# EasyEDA Pro project IPM_24V_12V分电板.eprj

# Schematic Schematic1

## Sheets
1 P1: Board Name: Board1; Create Date: 2025-09-07; Page Name: P1; Project Name: IPM_24V_12V分电板; Schematic Name: Schematic1; Update Date: 2025-10-30; Company: 嘉立创EDA; Page Size: A4; Version: V1.0
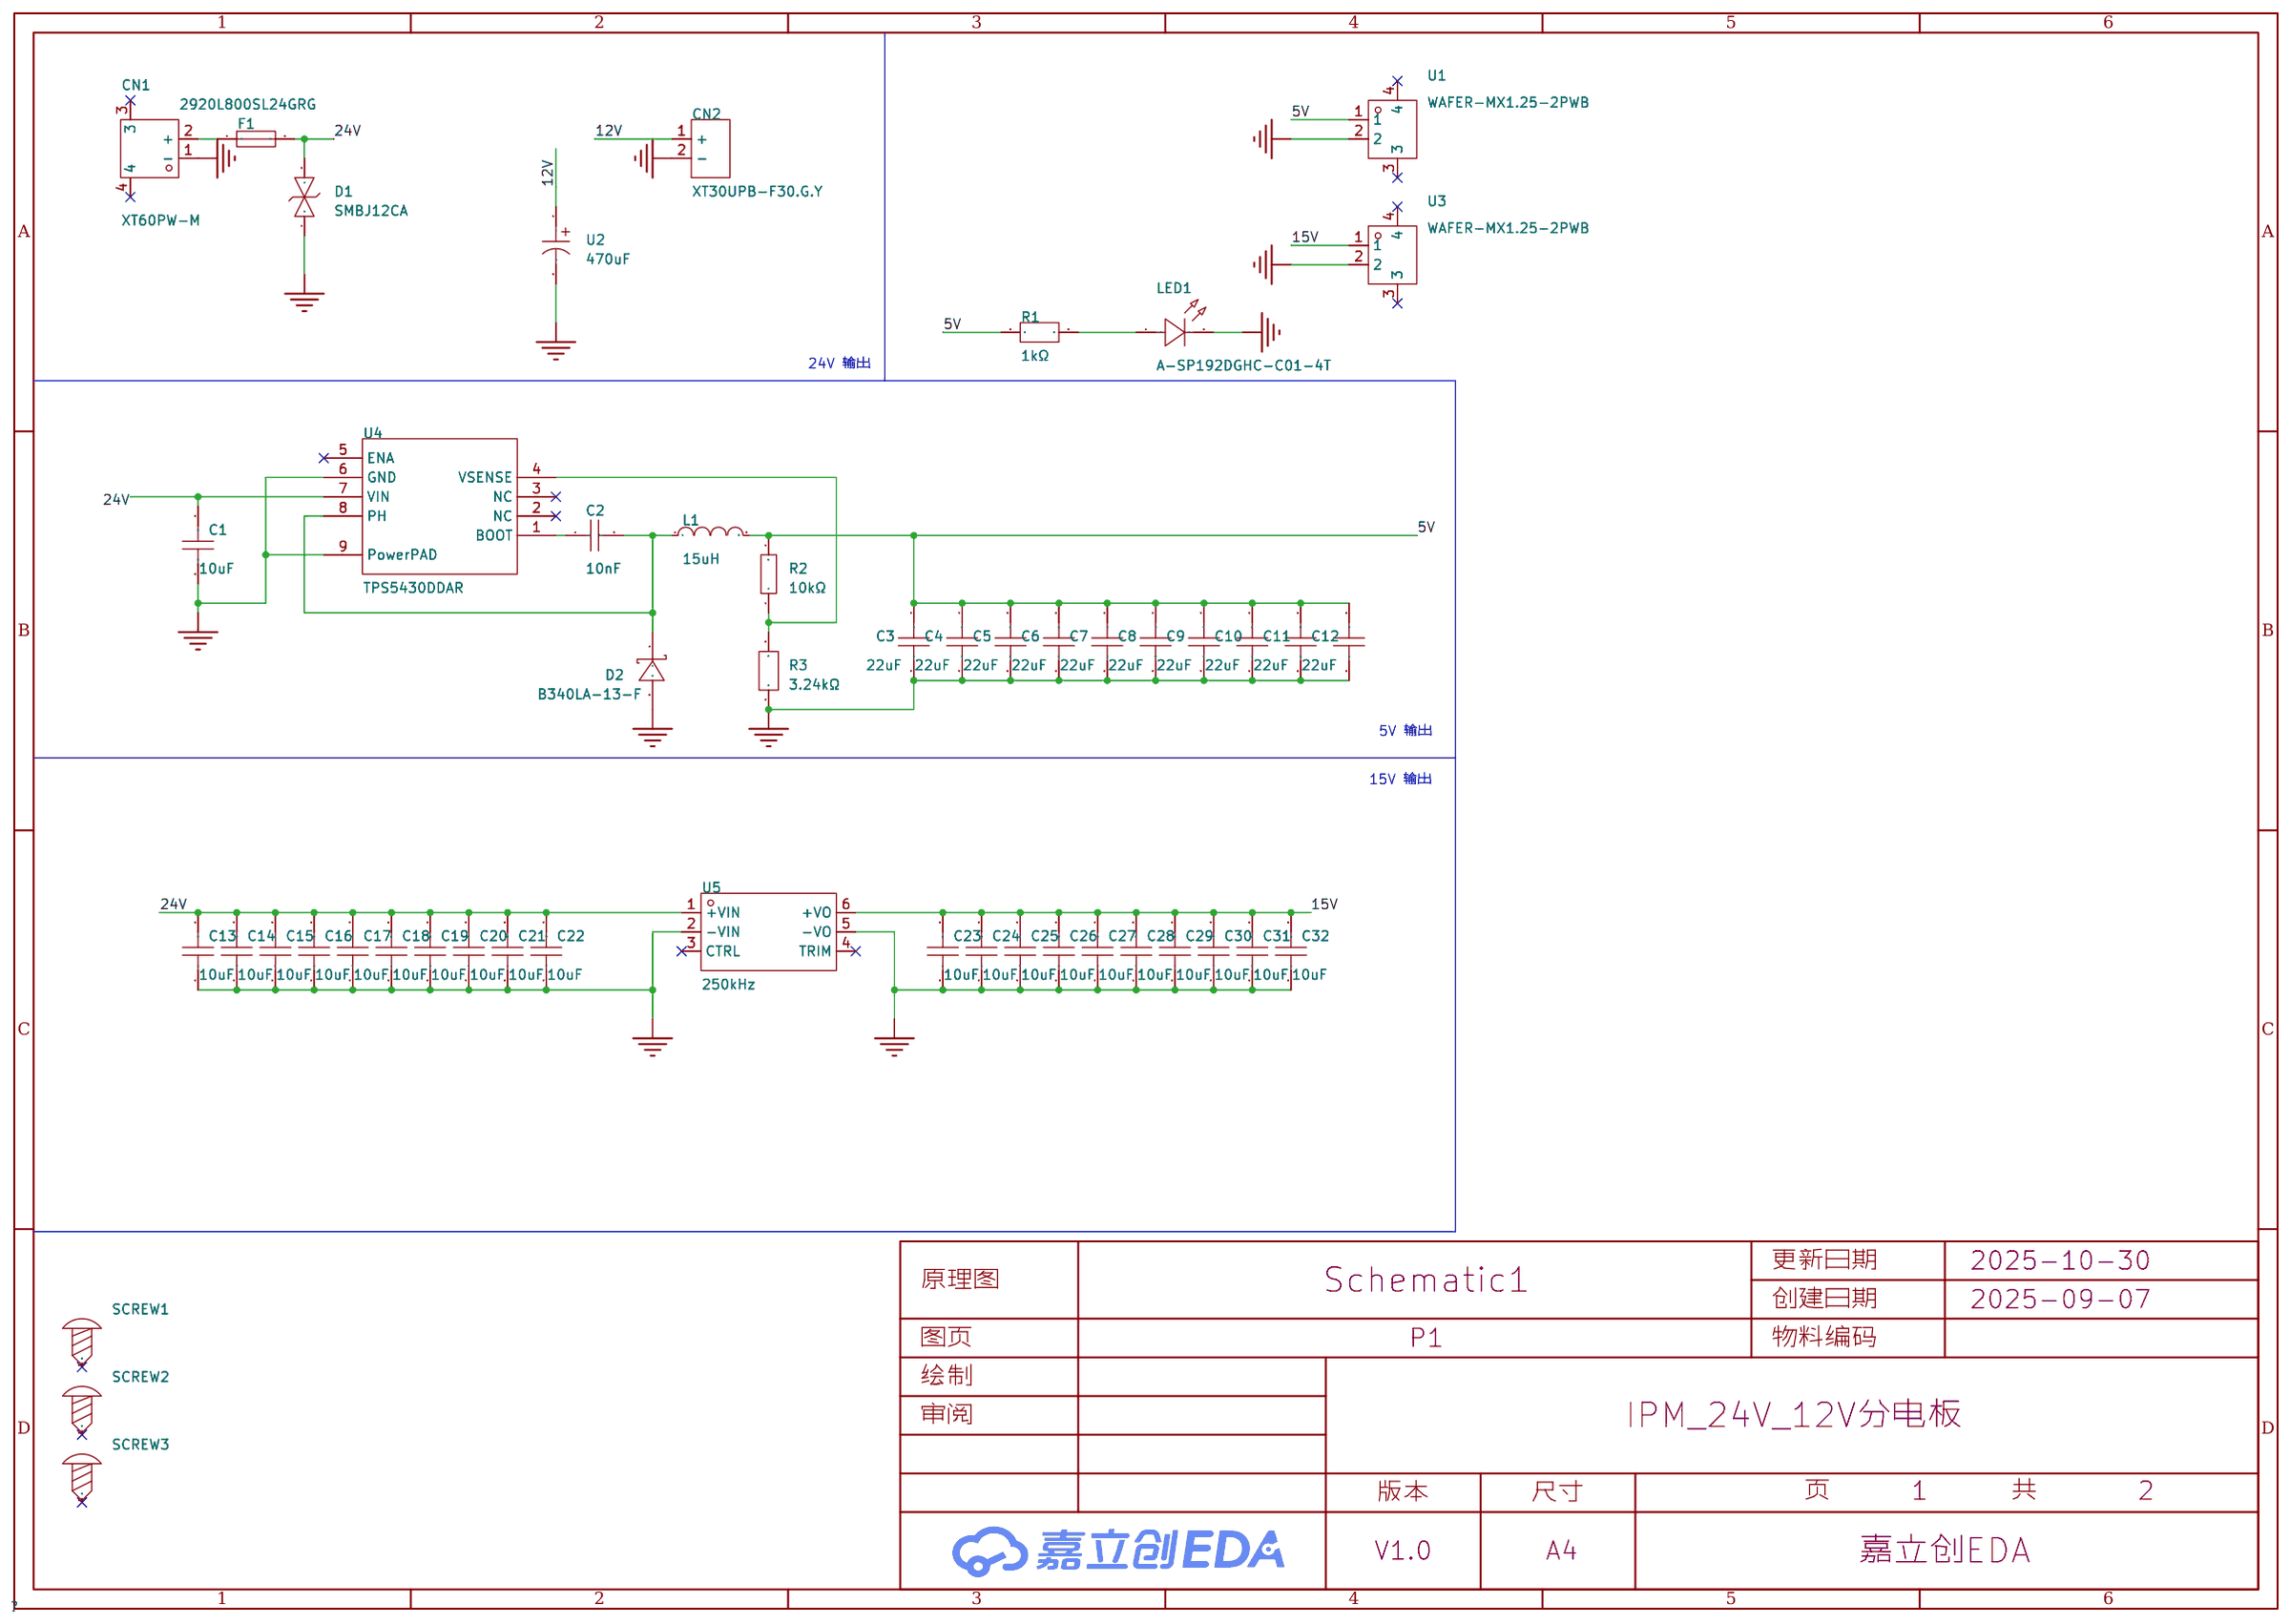
[diagram p0: P1]
2 P2: Create Date: 2025-10-30; Page Name: P2
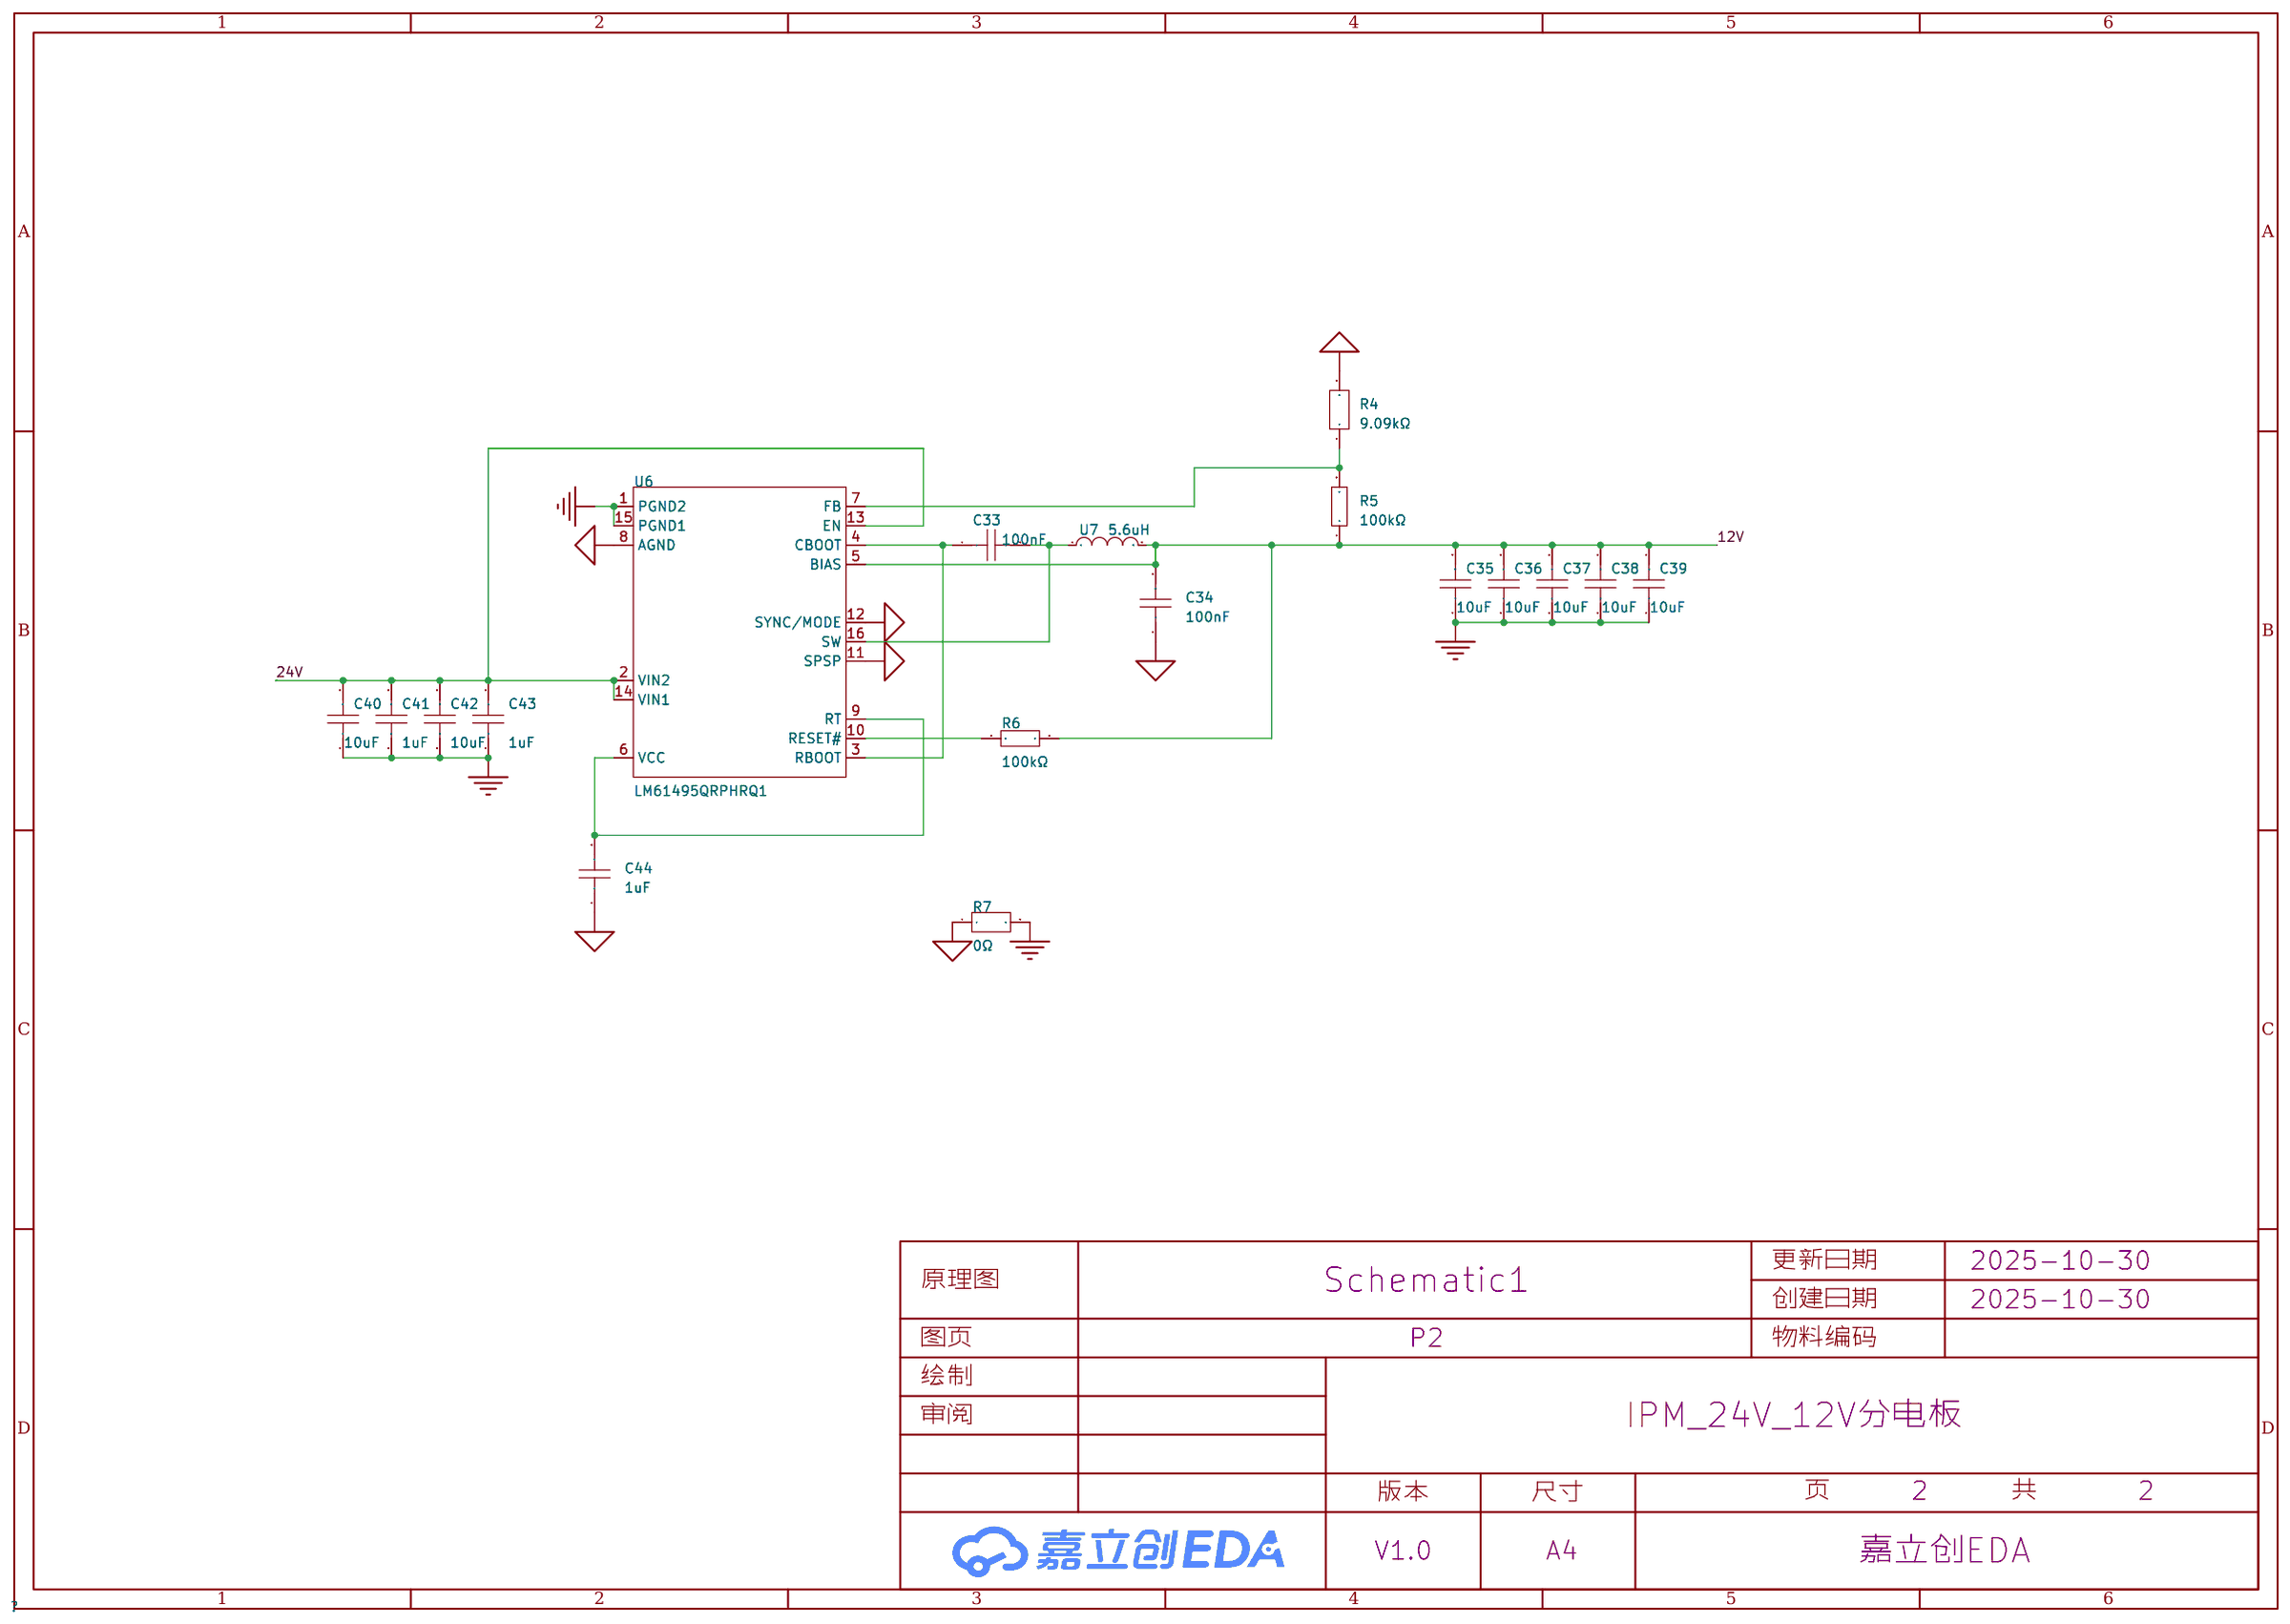
[diagram p1: P2]

## Parts
sheet P1
C1  10uF  [C1206]
C2  10nF  [C0603]
C3  22uF  [C0603]
C4  22uF  [C0603]
C5  22uF  [C0603]
C6  22uF  [C0603]
C7  22uF  [C0603]
C8  22uF  [C0603]
C9  22uF  [C0603]
C10  22uF  [C0603]
C11  22uF  [C0603]
C12  22uF  [C0603]
C13  10uF  [C1206]
C14  10uF  [C1206]
C15  10uF  [C1206]
C16  10uF  [C1206]
C17  10uF  [C1206]
C18  10uF  [C1206]
C19  10uF  [C1206]
C20  10uF  [C1206]
C21  10uF  [C1206]
C22  10uF  [C1206]
C23  10uF  [C1206]
C24  10uF  [C1206]
C25  10uF  [C1206]
C26  10uF  [C1206]
C27  10uF  [C1206]
C28  10uF  [C1206]
C29  10uF  [C1206]
C30  10uF  [C1206]
C31  10uF  [C1206]
C32  10uF  [C1206]
CN1  XT60PW-M  [CONN-TH_XT60PW-M]
CN2  XT30UPB-F30.G.Y  [CONN-TH_XT30UPB-F]
D1  SMBJ12CA  [SMB_L4.6-W3.6-LS5.4-BI]
D2  B340LA-13-F  [SMA_L4.3-W2.6-LS5.2-RD]
F1  2920L800SL24GRG  [F2920]
L1  15uH  [IND-SMD_L7.0-W6.6_FXL0630]
LED1  A-SP192DGHC-C01-4T  [LED0603-FD]
R1  1kΩ  [R0603]
R2  10kΩ  [R0603]
R3  3.24kΩ  [R0603]
SCREW1  -  [M2螺丝]
SCREW2  -  [M2螺丝]
SCREW3  -  [M2螺丝]
U1  WAFER-MX1.25-2PWB  [CONN-SMD_2P-P1.25_XUNPU_WAFER-MX1.25-2PWB]
U2  470uF  [CAP-TH_BD10.0-P5.00-D1.0-FD]
U3  WAFER-MX1.25-2PWB  [CONN-SMD_2P-P1.25_XUNPU_WAFER-MX1.25-2PWB]
U4  TPS5430DDAR  [ESOP-8_L4.9-W3.9-P1.27-LS6.0-TL-EP]
U5  250kHz  [PWRM-TH_URB2415LD-30WR3]
sheet P2
C33  100nF  [C0603]
C34  100nF  [C0603]
C35  10uF  [C1206]
C36  10uF  [C1206]
C37  10uF  [C1206]
C38  10uF  [C1206]
C39  10uF  [C1206]
C40  10uF  [C1206]
C41  1uF  [C1206]
C42  10uF  [C1206]
C43  1uF  [C1206]
C44  1uF  [C0603]
R4  9.09kΩ  [R0603]
R5  100kΩ  [R0603]
R6  100kΩ  [R0603]
R7  0Ω  [R1206]
U6  LM61495QRPHRQ1  [VQFN-16_L4.5-W3.5-P0.50-TL_TI_RPH]
U7  5.6uH  [IND-SMD_L6.6-W6.4]

## Library data of the parts
C1 C13-C32 C35-C40 C42 = CL31B106KBHNNNE: 容值:10uF;精度:±10%;额定电压:50V;温度系数:X7R;; LCSC Part Name: 10uF ±10% 50V; Supplier Part: C89632; Manufacturer: SAMSUNG(三星); Supplier Footprint: 1206; JLCPCB Part Class: 扩展库; Datasheet: https://item.szlcsc.com/datasheet/CL31B106KBHNNNE/90812.html; Supplier: LCSC; Tolerance: ±10%; Voltage Rating: 50V; Temperature Coefficient: X7R
C2 = CL10B103KB8NNNC: LCSC Part Name: 10nF ±10% 50V; Supplier Part: C1589; Manufacturer: SAMSUNG(三星); Supplier Footprint: 0603; JLCPCB Part Class: 扩展库; Datasheet: https://item.szlcsc.com/datasheet/CL10B103KB8NNNC/1941.html; Supplier: LCSC; Tolerance: ±10%; Voltage Rating: 50V; Temperature Coefficient: X7R
C3-C12 = CL10A226MO7JZNC: LCSC Part Name: 22uF ±20% 16V; Supplier Part: C2762594; Manufacturer: SAMSUNG(三星); Supplier Footprint: 0603; JLCPCB Part Class: 扩展库; Datasheet: https://item.szlcsc.com/datasheet/CL10A226MO7JZNC/2889856.html; Supplier: LCSC; Tolerance: ±20%; Voltage Rating: 16V; Temperature Coefficient: X5R
CN1 = XT60PW-M: LCSC Part Name: AMASS(艾迈斯)航模插头xt60连接器150公母对接pw锂电池公头 板插卧式XT60PW-M; Supplier Part: C98732; Manufacturer: AMASS(艾迈斯); JLCPCB Part Class: 扩展库; Datasheet: https://item.szlcsc.com/datasheet/XT60PW-M/99942.html; Supplier: LCSC; Type: 卧式插头; Colour: 黄色; InterfaceType: 公头
CN2 = XT30UPB-F30.G.Y: LCSC Part Name: AMASS(艾迈斯)直立焊板式连接器XT30UPB30-F.G.*; Supplier Part: C108769; Manufacturer: AMASS(艾迈斯); JLCPCB Part Class: 扩展库; Datasheet: https://item.szlcsc.com/datasheet/XT30UPB-F30.G.Y/109989.html; Supplier: LCSC; Type: 航模插头; Colour: 黄色; RatedVoltage: DC 500V; InterfaceType: 母头; MetalMaterial: 镀金; InsulationMaterial: PA; RatedCurrent: 15A; contact resistance: 0.65mΩ
D1 = SMBJ12CA_C19077566: LCSC Part Name: 双向TVS 12V截止 峰值浪涌电流：30.15A@10/1000us; Supplier Part: C19077566; Manufacturer: R+O(宏嘉诚); Supplier Footprint: DO-214AA(SMB); JLCPCB Part Class: 扩展库; Datasheet: https://item.szlcsc.com/datasheet/SMBJ12CA/20275651.html; Supplier: LCSC; Polarity: 双向; Reverse Stand-Off Voltage (Vrwm): 12V; Clamping Voltage: 19.9V; Peak Pulse Current (Ipp): 30.15A@10/1000us; Peak Pulse Power Dissipation (Ppp): 600W@10/1000us; Voltage - Breakdown: 14.7V; Reverse Leakage Current (Ir): 5uA; Number of Channels: 单路; Operating Temperature: -55℃~+150℃; level of protection: IEC 61000-4-2; Type: TVS
D2 = B340LA-13-F: LCSC Part Name: 电压:40V 电流:3A; Supplier Part: C17101; Manufacturer: DIODES(美台); Supplier Footprint: SMA(DO-214AC); JLCPCB Part Class: 扩展库; Datasheet: https://atta.szlcsc.com/upload/public/pdf/source/20171023/C97318_15087455366241052881.pdf; Supplier: LCSC; Forward Voltage (Vf@If): 450mV@3A; Reverse Voltage (Vr): 40V; Average Rectified Current (Io): 3A; Reverse Leakage Current (Ir): 2mA@40V
F1 = 2920L800SL24GRG: LCSC Part Name: 24V 8.00A 2920 低内阻; Supplier Part: C47345588; Manufacturer: LUTE(陆特); Supplier Footprint: 2920; JLCPCB Part Class: 扩展库; Datasheet: https://item.szlcsc.com/datasheet/2920L800SL24GRG/49561096.html; Supplier: LCSC; Voltage - Max: 24V; Current - Max: 50A; Hold Current: 8A; Trip Current: 16A; Power Dissipation: 2W; Resistance - Initial (Ri) (Min): 0.6mΩ; Resistance - Post Trip (R1) (Max): 0.8mΩ; Time to Trip(Max): 5s; Operating Temperature: -40℃~+85℃
L1 = FXL0630-150-M: LCSC Part Name: 15uH ±20%; Supplier Part: C177243; Manufacturer: cjiang(长江微电); Supplier Footprint: SMD,6.6x7mm; JLCPCB Part Class: 扩展库; Datasheet: https://atta.szlcsc.com/upload/public/pdf/source/20250421/DC75C633ACB13F952A25DE8912719752.pdf; Supplier: LCSC; Tolerance: ±20%; Current Rating: 3A; Current - Saturation(Isat): 4A; DC Resistance(DCR): 115mΩ; Type: 一体成型电感
LED1 = A-SP192DGHC-C01-4T: LCSC Part Name: 0603高亮绿灯正贴; Supplier Part: C19171301; Manufacturer: Amicc(欧密格光电); Supplier Footprint: 0603; JLCPCB Part Class: 扩展库; Datasheet: https://atta.szlcsc.com/upload/public/pdf/source/20231108/CAA90604E374CB6B31BBE970B55159E7.pdf; Supplier: LCSC; Emitted Color: 绿色; Forward Voltage (VF): 2.4V~3V; Power Dissipation: 70mW; Dominant Wavelength: 520nm~535nm; Lens Color: 无色透明透镜; Luminous Intensity: 225mcd~450mcd; Viewing Angle: 120°; Mounting Sytle: 正贴; Operating Temperature: -40℃~+85℃
R1 = FRC0603F1001TS: LCSC Part Name: 1kΩ ±1% 100mW 厚膜电阻; Supplier Part: C2907002; Manufacturer: FOJAN(富捷); Supplier Footprint: 0603; JLCPCB Part Class: 扩展库; Supplier: LCSC; Type: 厚膜电阻; Tolerance: ±1%; Power(Watts): 100mW; Voltage-Supply(Max): 75V; Temperature Coefficient: ±100ppm/℃; Operating Temperature: -55℃~+155℃
R2 = 0603WAF1002T5E: LCSC Part Name: 厚膜电阻 10kΩ ±1% 100mW; Supplier Part: C25804; Manufacturer: UNI-ROYAL(厚声); Supplier Footprint: 0603; JLCPCB Part Class: 基础库; Datasheet: https://item.szlcsc.com/datasheet/0603WAF1002T5E/26547.html; Supplier: LCSC; Type: 厚膜电阻; Tolerance: ±1%; Power(Watts): 100mW; Voltage-Supply(Max): 75V; Temperature Coefficient: ±100ppm/℃; Operating Temperature: -55℃~+155℃
R3 = FRC0603F3241TS: LCSC Part Name: 3.24kΩ ±1% 100mW 厚膜电阻; Supplier Part: C2933197; Manufacturer: FOJAN(富捷); Supplier Footprint: 0603; JLCPCB Part Class: 扩展库; Datasheet: https://item.szlcsc.com/datasheet/FRC0603F3241TS/3279299.html; Supplier: LCSC; Type: 厚膜电阻; Tolerance: ±1%; Power(Watts): 100mW; Voltage-Supply(Max): 75V; Temperature Coefficient: ±100ppm/℃; Operating Temperature: -55℃~+155℃
SCREW1-SCREW3 = M2螺丝: Supplier Footprint: 插件
U1 U3 = WAFER-MX1.25-2PWB: LCSC Part Name: 1x2P 间距:1.25mm 卧贴 系列:PicoBlade(MX 1.25); Supplier Part: C3029359; Manufacturer: XUNPU(讯普); Supplier Footprint: SMD,P=1.25mm,卧贴; JLCPCB Part Class: 扩展库; Datasheet: https://item.szlcsc.com/datasheet/WAFER-MX1.25-2PWB/3561371.html; Supplier: LCSC; Pins Structure: 1x2P; Pitch: 1.25mm; Mounting Type: 卧贴; Reference Series: PicoBlade(MX 1.25); Number of Pins: 2P; Number of Rows: 1; Number of PINs Per Row: 2; Current Rating: 1A; Contact Material: 黄铜; Contact Plating: 锡; Operating Temperature: -25℃~+85℃; Voltage Rating: 125V; Plastic Material: LCP; Supplementary Features: 辅助焊脚; Color: 米色; Z-Height of the Board: 3.6mm; X-Length of Bottom Edge on Board (Spacing Line): 7.5mm; Y-Width of Bottom Edge on Board: 5.25mm
U2 = ERJ1HM471G16C36T: LCSC Part Name: 470uF ±20% 50V; Supplier Part: C3038120; Manufacturer: AISHI(艾华集团); Supplier Footprint: 插件,D10xL16mm; JLCPCB Part Class: 扩展库; Datasheet: https://item.szlcsc.com/datasheet/ERJ1HM471G16C36T/3590505.html; Supplier: LCSC; Tolerance: ±20%; Voltage Rating: 50V; Diameter: 10mm; Height - Seated (Max): 16mm; Operating Temperature: -40℃~+105℃
U4 = TPS5430DDAR: LCSC Part Name: 宽输入范围、3A输出电流的降压转换器; Supplier Part: C9864; Manufacturer: TI(德州仪器); Supplier Footprint: SOIC-8-EP; JLCPCB Part Class: 基础库; Datasheet: https://www.ti.com/cn/lit/gpn/tps5430; Supplier: LCSC; Function: 降压型; Output Type: 可调; Input Voltage: 5.5V~36V; Output Voltage: 1.221V~32.04V; Output Current: 3A; Switching Frequency: 500kHz; Operating Temperature: -40℃~+125℃@(TJ); Synchronous Rectification: 否; Number of Outputs: 1; Topology: 降压式; Switch tube (built-in/external): 内置
U5 = URB2415LD-30WR3_C5369835: LCSC Part Name: 30W DC/DC电源模块，超宽范围输入，高转换效率，多保护功能; Supplier Part: C5369835; Manufacturer: YLPTEC(易川); Manufacturer Part: URB2415LD-30WR3; Supplier Footprint: DIP,50.8x25.4mm; Datasheet: https://item.szlcsc.com/datasheet/URB2415LD-30WR3/6212877.html; Supplier: LCSC; Number of Channels: 1; Output Power: 30W; Voltage - Supply: 9V~36V; Conversion Efficiency: 90%; Output Voltage: 15V; Output Current(Max): 2A; Capacitive Load(Max): 1000uF; Isolation Voltage(Vrms): 1.5kV; Features: 短路保护; Operating Temperature: -40℃~+85℃; Ripple Noise: 50mVp-p; Length: 50.8mm; Width: 25.4mm; Height: 12mm
C33 C34 = CC0603KRX7R9BB104: LCSC Part Name: 100nF ±10% 50V; Supplier Part: C14663; Manufacturer: YAGEO(国巨); Supplier Footprint: 0603; JLCPCB Part Class: 基础库; Datasheet: https://item.szlcsc.com/datasheet/CC0603KRX7R9BB104/15331.html; Supplier: LCSC; Tolerance: ±10%; Voltage Rating: 50V; Temperature Coefficient: X7R
C41 C43 = CL31B105KBHNNNE: LCSC Part Name: 1uF ±10% 50V; Supplier Part: C1848; Manufacturer: SAMSUNG(三星); Supplier Footprint: 1206; JLCPCB Part Class: 基础库; Datasheet: https://item.szlcsc.com/datasheet/CL31B105KBHNNNE/2200.html; Supplier: LCSC; Tolerance: ±10%; Voltage Rating: 50V; Temperature Coefficient: X7R
C44 = CL10A105KB8NNNC: LCSC Part Name: 1uF ±10% 50V; Supplier Part: C15849; Manufacturer: SAMSUNG(三星); Supplier Footprint: 0603; JLCPCB Part Class: 基础库; Datasheet: https://item.szlcsc.com/datasheet/CL10A105KB8NNNC/16531.html; Supplier: LCSC; Tolerance: ±10%; Voltage Rating: 50V; Temperature Coefficient: X5R
R4 = RT0603BRD079K09L: LCSC Part Name: 薄膜电阻 9.09kΩ ±0.1% 100mW; Supplier Part: C861611; Manufacturer: YAGEO(国巨); Supplier Footprint: 0603; Datasheet: https://atta.szlcsc.com/upload/public/pdf/source/20200610/C326738_5639A9F1B6EB6E4AE2197577D3456E7F.pdf; Supplier: LCSC; Type: 薄膜电阻; Tolerance: ±0.1%; Power(Watts): 100mW; Temperature Coefficient: ±25ppm/℃; Operating Temperature Range: -55℃~+155℃
R5 R6 = 0603WAF1003T5E: LCSC Part Name: 100kΩ ±1% 100mW 厚膜电阻; Supplier Part: C25803; Manufacturer: UNI-ROYAL(厚声); Supplier Footprint: 0603; JLCPCB Part Class: 基础库; Datasheet: https://item.szlcsc.com/datasheet/0603WAF1003T5E/26546.html; Supplier: LCSC; Type: 厚膜电阻; Tolerance: ±1%; Power(Watts): 100mW; Voltage-Supply(Max): 75V; Temperature Coefficient: ±100ppm/℃; Operating Temperature: -55℃~+155℃
R7 = RE1206F1R000: LCSC Part Name: 0mΩ 1W 1206 ±1%; Supplier Part: C46961765; Manufacturer: JIERR(捷而瑞); Supplier Footprint: 1206; JLCPCB Part Class: 扩展库; Datasheet: https://item.szlcsc.com/datasheet/RE1206F1R000/49133304.html; Supplier: LCSC; Type: 采样电阻；合金电阻; Tolerance: ±1%; Power(Watts): 1W
U6 = LM61495QRPHRQ1: LCSC Part Name: 针对功率密度和低EMI进行优化的汽车类降压转换器; Supplier Part: C3188410; Manufacturer: TI(德州仪器); Supplier Footprint: VQFN-16-HR(4.5x3.5); JLCPCB Part Class: 扩展库; Datasheet: http://www.ti.com/cn/lit/gpn/lm61495-q1; Supplier: LCSC; Function: 降压型; Voltage - Supply: 3V~36V; Output Voltage: 1V~34.2V; Output Current: 10A; Frequency - Switching: 2.2MHz; Operating Temperature: -40℃~+150℃@(TJ); Number of Outputs: 1; Topology: 降压式; Quiescent Current: 10uA; Switch tube (built-in/external): 内置; Output Type: 可调
U7 = FEXL0660A-5R6M: LCSC Part Name: 5.6uH ±20% 9.9A 合金扁线超大电流，一体成型电感; Supplier Part: C5378545; Manufacturer: cjiang(长江微电); Supplier Footprint: SMD,6.6x6.4mm; JLCPCB Part Class: 扩展库; Datasheet: https://atta.szlcsc.com/upload/public/pdf/source/20240409/B9FA7ECCC3220F3F7C7BE8F7B1FCE238.pdf; Supplier: LCSC; Tolerance: ±20%; Current Rating: 10A; Current - Saturation(Isat): 9.9A; DC Resistance(DCR): 15.9mΩ; Ratings: AEC-Q200

## Nets
5V: C3.1 C4.1 C5.1 C6.1 C7.1 C8.1 C9.1 C10.1 C11.1 C12.1 L1.2 R1.1 R2.2 U1.1
12V: C34.2 C35.2 C36.2 C37.2 C38.2 C39.2 CN2.1(+) R5.1 R6.2 U2.1 U6.5(BIAS) U7.2
15V: C23.2 C24.2 C25.2 C26.2 C27.2 C28.2 C29.2 C30.2 C31.2 C32.2 U3.1 U5.6(+VO)
24V: C1.2 C13.2 C14.2 C15.2 C16.2 C17.2 C18.2 C19.2 C20.2 C21.2 C22.2 C40.2 C41.2 C42.2 C43.2 D1.2 F1.2 U4.7(VIN) U5.1(+VIN) U6.2(VIN2) U6.13(EN) U6.14(VIN1)
AGND: C34.1 C44.1 R4.2 R7.1 U6.8(AGND) U6.11(SPSP) U6.12(SYNC/MODE)
GND: C1.1 C3.2 C4.2 C5.2 C6.2 C7.2 C8.2 C9.2 C10.2 C11.2 C12.2 C13.1 C14.1 C15.1 C16.1 C17.1 C18.1 C19.1 C20.1 C21.1 C22.1 C23.1 C24.1 C25.1 C26.1 C27.1 C28.1 C29.1 C30.1 C31.1 C32.1 C35.1 C36.1 C37.1 C38.1 C39.1 C40.1 C41.1 C42.1 C43.1 CN1.1(-) CN2.2(-) D1.1 D2.2(A) LED1.2(K) R3.1 R7.2 U1.2 U2.2 U3.2 U4.6(GND) U4.9(PowerPAD) U5.2(-VIN) U5.5(-VO) U6.1(PGND2) U6.15(PGND1)
$1N1431: C2.2 D2.1(K) L1.1 U4.8(PH)
$1N1787: R2.1 R3.2 U4.4(VSENSE)
$1N3489: LED1.1(A) R1.2
$1N5102: CN1.2(+) F1.1
$1N5856: C2.1 U4.1(BOOT)
$2N684: C44.2 U6.6(VCC) U6.9(RT)
$2N845: C33.1 U6.3(RBOOT) U6.4(CBOOT)
$2N860: C33.2 U6.16(SW) U7.1
$2N1084: R6.1 U6.10(RESET#)
$2N1211: R4.1 R5.2 U6.7(FB)

Not connected (* = marked no-connect by the designer): CN1 3* 4*; SCREW1 1*; SCREW2 1*; SCREW3 1*; U1 3* 4*; U3 3* 4*; U4 2(NC)* 3(NC)* 5(ENA)*; U5 3(CTRL)* 4(TRIM)*

## Notes on the sheets
sheet 1
- 24V 输出
- 5V 输出
- 15V 输出

# Board PCB1
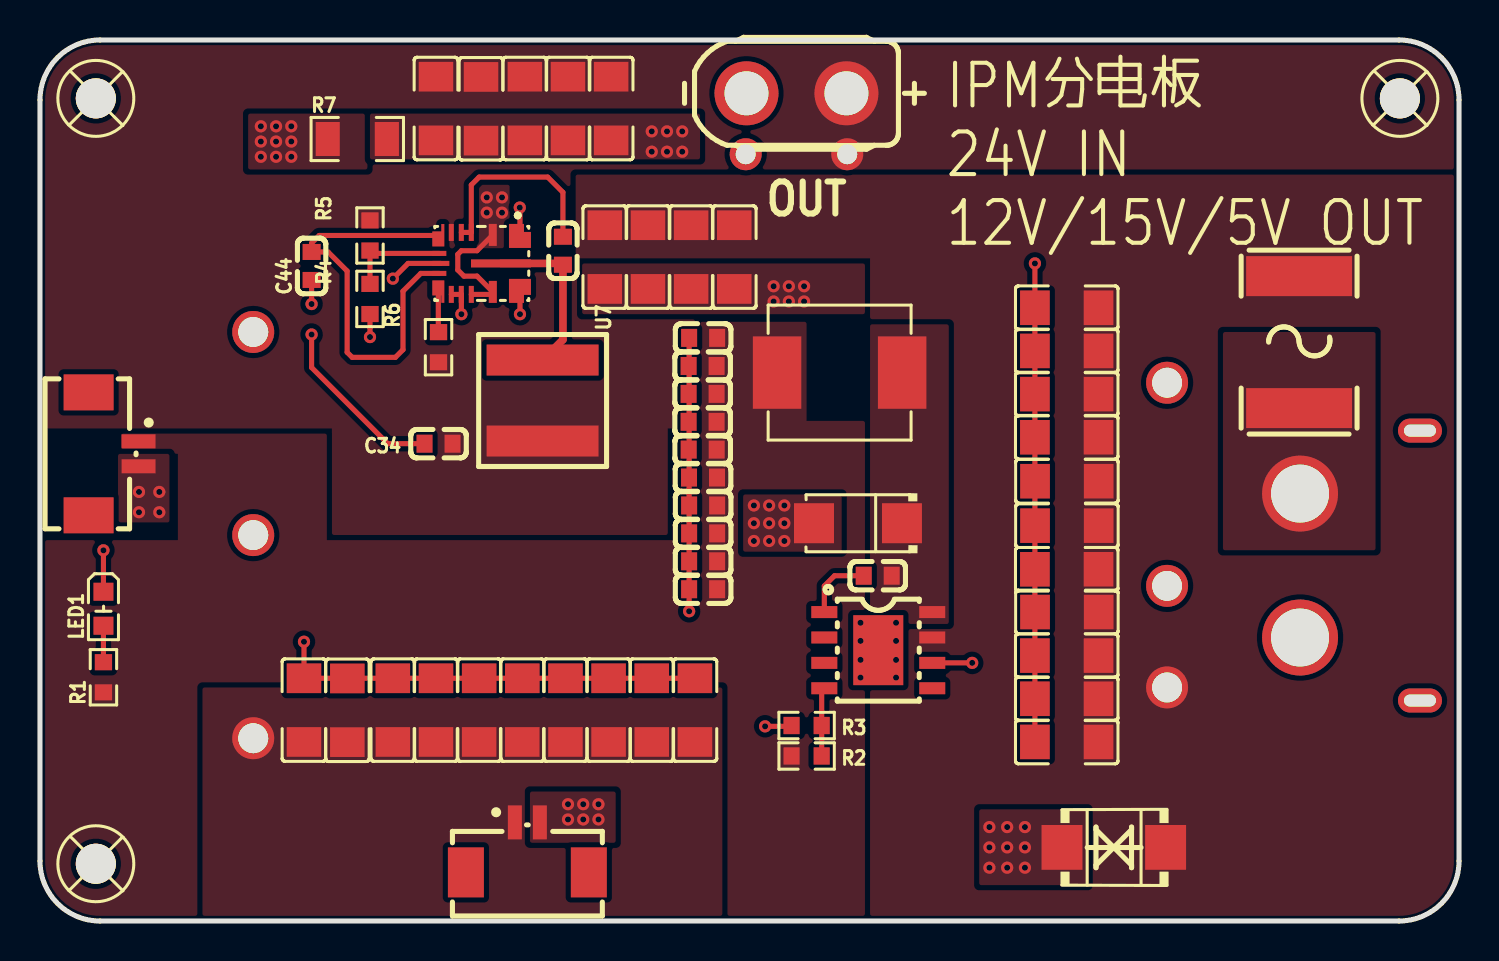
[diagram p2: board, top side]
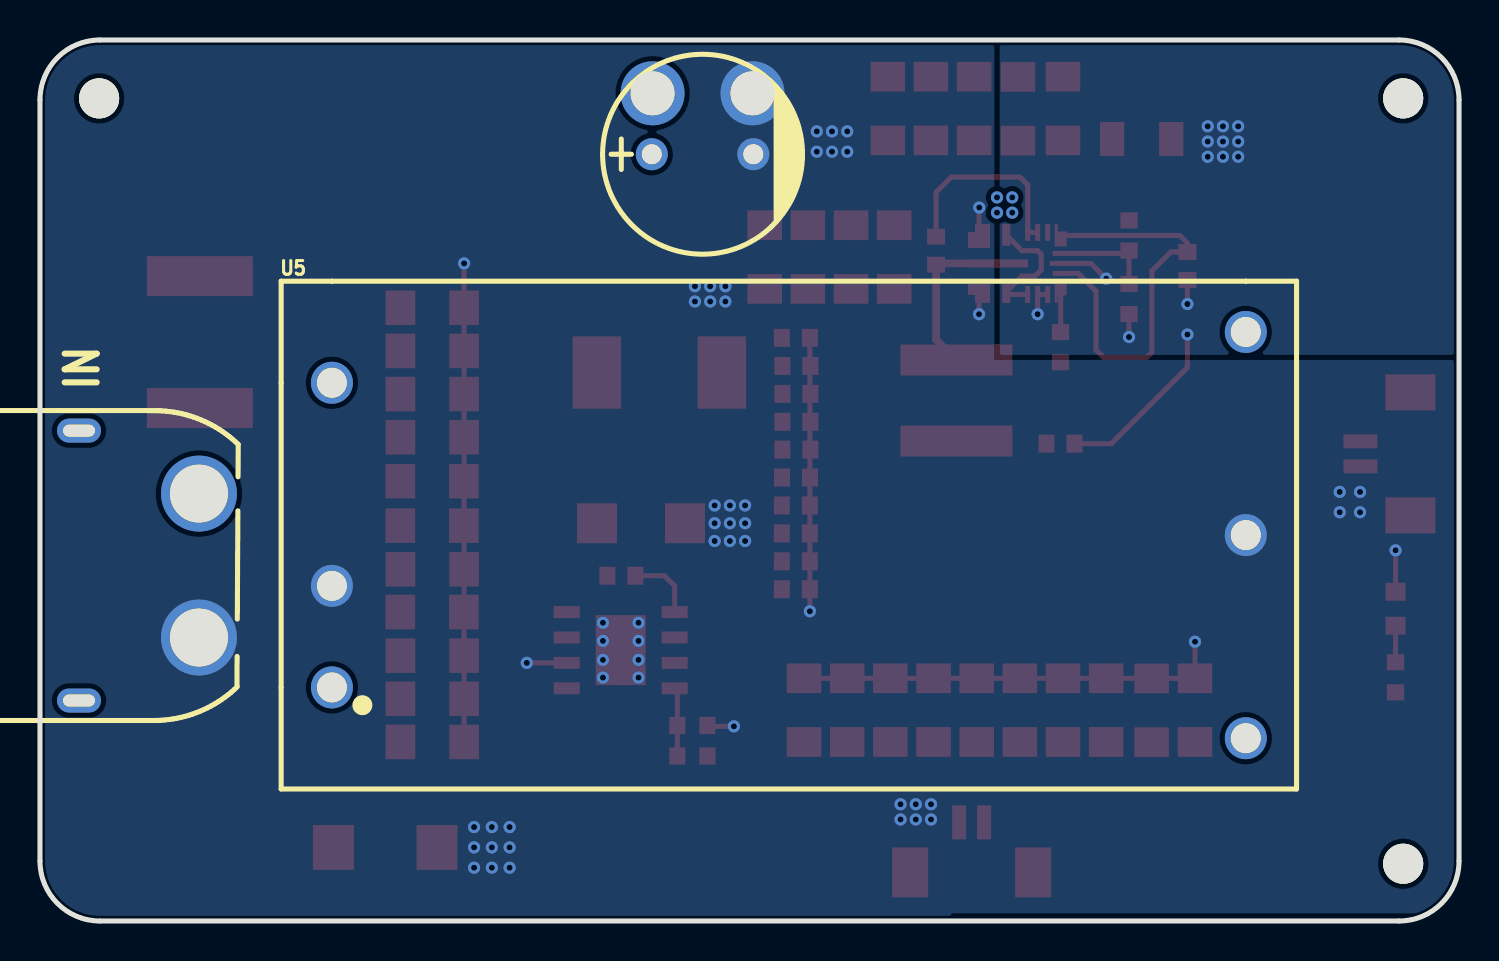
[diagram p3: board, bottom side, seen from below]

Outline 70.99 x 44.07 mm; copper layers: Top Layer, Inner1, Inner2, Bottom Layer. Coordinates in mm from the lower left corner of the outline.
Outline path: 0,41.07 0,3 arc(0.88,0.88) 3,0 67.99,0 arc(70.11,0.88) 70.99,3 70.99,41.07 arc(70.11,43.19) 67.99,44.07 3,44.07 arc(0.88,43.19) 0,41.07
Stack: Top Layer 0.035mm 外层铜厚1oz / Dielectric1 0.2104mm 7628 RC49% 8.6mil / Inner1 0.0152mm 内层铜厚 / Dielectric2 1.065mm 1.1mm H/HOZ Copper / Inner2 0.0152mm 内层铜厚 / Dielectric3 0.2104mm 7628 RC49% 8.6mil / Bottom Layer 0.035mm 外层铜厚1oz

## Design rules (mm)
template: 自定义配置
spacing copperThickness1oz (default): track to track 0.102, other pairs 0.152 to 0.3
spacing copperThickness2oz: track to track 0.203, other pairs 0.152 to 0.3
track width copperThickness1oz (default): min 0.127, default 0.254, max 2.54
track width copperThickness2oz: min 0.203, default 0.254, max 2.54
differential pair differentialPair (default): width min 0.127, default 0.254, max 2.54; gap min 0.152, default 0.152
via viaSize (default): diameter min 0.5, default 0.61, max 10; hole min 0.3, default 0.305, max 6.3

## Placement (name value [footprint] x y rotation side)
C1  10uF  [C1206]  51.37 30.67 0 top
C2  10nF  [C0603]  41.91 17.27 0 top
C3  22uF  [C0603]  33.18 17.99 180 top
C4  22uF  [C0603]  33.18 19.39 180 top
C5  22uF  [C0603]  33.18 16.6 180 top
C6  22uF  [C0603]  33.17 22.18 180 top
C7  22uF  [C0603]  33.15 27.76 180 top
C8  22uF  [C0603]  33.18 29.17 180 top
C9  22uF  [C0603]  33.15 26.37 180 top
C10  22uF  [C0603]  33.15 24.97 180 top
C11  22uF  [C0603]  33.15 23.58 180 top
C12  22uF  [C0603]  33.18 20.79 180 top
C13  10uF  [C1206]  51.37 28.52 0 top
C14  10uF  [C1206]  51.37 26.36 0 top
C15  10uF  [C1206]  51.37 24.2 0 top
C16  10uF  [C1206]  51.37 11.12 0 top
C17  10uF  [C1206]  51.37 8.96 0 top
C18  10uF  [C1206]  51.38 22 0 top
C19  10uF  [C1206]  51.38 19.78 0 top
C20  10uF  [C1206]  51.37 17.59 0 top
C21  10uF  [C1206]  51.38 15.46 0 top
C22  10uF  [C1206]  51.37 13.28 0 top
C23  10uF  [C1206]  30.61 10.55 270 top
C24  10uF  [C1206]  32.77 10.55 270 top
C25  10uF  [C1206]  28.45 10.55 270 top
C26  10uF  [C1206]  26.29 10.55 270 top
C27  10uF  [C1206]  24.13 10.55 270 top
C28  10uF  [C1206]  21.97 10.55 270 top
C29  10uF  [C1206]  19.81 10.55 270 top
C30  10uF  [C1206]  17.65 10.55 270 top
C31  10uF  [C1206]  15.38 10.54 270 top
C32  10uF  [C1206]  13.21 10.55 270 top
C33  100nF  [C0603]  26.16 33.53 270 top
C34  100nF  [C0603]  19.94 23.88 0 top
C35  10uF  [C1206]  19.81 40.64 90 top
C36  10uF  [C1206]  22.06 40.63 90 top
C37  10uF  [C1206]  24.26 40.64 90 top
C38  10uF  [C1206]  28.57 40.64 90 top
C39  10uF  [C1206]  26.42 40.64 90 top
C40  10uF  [C1206]  30.42 33.21 90 top
C41  1uF  [C1206]  28.26 33.21 90 top
C42  10uF  [C1206]  34.73 33.21 90 top
C43  1uF  [C1206]  32.58 33.21 90 top
C44  1uF  [C0603]  13.59 32.77 90 top
CN1  XT60PW-M  [CONN-TH_XT60PW-M]  66.04 17.78 180 bottom
CN2  XT30UPB-F30.G.Y  [CONN-TH_XT30UPB-F]  37.85 41.4 180 top
D1  SMBJ12CA  [SMB_L4.6-W3.6-LS5.4-BI]  53.72 3.68 0 top
D2  B340LA-13-F  [SMA_L4.3-W2.6-LS5.2-RD]  40.92 19.9 180 top
F1  2920L800SL24GRG  [F2920]  62.99 28.96 90 top
L1  15uH  [IND-SMD_L7.0-W6.6_FXL0630]  40 27.43 0 top
LED1  A-SP192DGHC-C01-4T  [LED0603-FD]  3.17 15.62 90 top
R1  1kΩ  [R0603]  3.17 12.19 90 top
R2  10kΩ  [R0603]  38.35 8.25 180 top
R3  3.24kΩ  [R0603]  38.35 9.78 0 top
R4  9.09kΩ  [R0603]  16.51 31.11 270 top
R5  100kΩ  [R0603]  16.51 34.29 270 top
R6  100kΩ  [R0603]  19.94 28.7 270 top
R7  0Ω  [R1206]  15.88 39.12 0 top
SCREW1  -  [M2螺丝]  2.79 41.15 0 top
SCREW2  -  [M2螺丝]  2.79 2.86 0 top
SCREW3  -  [M2螺丝]  68.03 41.15 0 top
U1  WAFER-MX1.25-2PWB  [CONN-SMD_2P-P1.25_XUNPU_WAFER-MX1.25-2PWB]  3.68 23.37 270 top
U2  470uF  [CAP-TH_BD10.0-P5.00-D1.0-FD]  37.85 38.35 180 bottom
U3  WAFER-MX1.25-2PWB  [CONN-SMD_2P-P1.25_XUNPU_WAFER-MX1.25-2PWB]  24.38 3.68 0 top
U4  TPS5430DDAR  [ESOP-8_L4.9-W3.9-P1.27-LS6.0-TL-EP]  41.94 13.55 0 top
U5  250kHz  [PWRM-TH_URB2415LD-30WR3]  33.53 19.3 180 bottom
U6  LM61495QRPHRQ1  [VQFN-16_L4.5-W3.5-P0.50-TL_TI_RPH]  21.97 32.89 270 top
U7  5.6uH  [IND-SMD_L6.6-W6.4]  25.15 26.03 270 top

## Footprints (pads in the part's own frame, mm; a bottom-side part is the same pattern mirrored in y, then rotated)
C0603
  rect 0.8x0.9 smd: 1(-0.7,0) 2(0.7,0)
C1206
  rect 1.485x1.728 smd: 1(-1.593,0) 2(1.593,0)
CAP-TH_BD10.0-P5.00-D1.0-FD
  round 1.6 hole 1: 1(-2.54,0) 2(2.54,0)
CONN-SMD_2P-P1.25_XUNPU_WAFER-MX1.25-2PWB
  rect 0.7x1.7 smd: 1(-0.625,1.25) 2(0.625,1.25)
  rect 1.8x2.5 smd: 3(3.075,-1.25) 4(-3.075,-1.25)
CONN-TH_XT30UPB-F
  round 3.2 hole 2.2: 1(-2.5,0) 2(2.5,0)
CONN-TH_XT60PW-M
  round 3.8 hole 2.9: 1(3,-3.6) 2(3,3.6)
  oval 2.2x1.2 hole 1.6x0.6: 3(-3,6.75) 4(-3,-6.75)
ESOP-8_L4.9-W3.9-P1.27-LS6.0-TL-EP
  rect 1.3x0.6 smd: 1(-2.7,1.905) 2(-2.7,0.635) 3(-2.7,-0.635) 4(-2.7,-1.905) 5(2.7,-1.905) 6(2.7,-0.635) 7(2.7,0.635) 8(2.7,1.905)
  rect 2.5x3.5 smd: 9(0,0)
F2920
  rect 2x5.3 smd: 1(-3.3,0) 2(3.3,0)
IND-SMD_L6.6-W6.4
  rect 1.55x5.6 smd: 1(-2.025,0) 2(2.025,0)
IND-SMD_L7.0-W6.6_FXL0630
  rect 2.424x3.62 smd: 1(3.128,0) 2(-3.128,0)
LED0603-FD
  rect 0.9x1 smd: 1(-0.85,0) 2(0.85,0)
M2螺丝
  round 2 hole 2: 1(0,0)
PWRM-TH_URB2415LD-30WR3
  round 2.1 hole 1.5: 1(-22.86,-7.62) 2(-22.86,-2.54) 3(-22.86,7.62) 4(22.86,10.16) 5(22.86,0) 6(22.86,-10.16)
R0603
  rect 0.806x0.864 smd: 1(-0.753,0) 2(0.753,0)
R1206
  rect 1.208x1.701 smd: 1(-1.479,0) 2(1.479,0)
SMA_L4.3-W2.6-LS5.2-RD
  rect 2x2 smd: 1(-2.2,0) 2(2.2,0)
SMB_L4.6-W3.6-LS5.4-BI
  rect 2.047x2.241 smd: 1(-2.591,0) 2(2.591,0)
VQFN-16_L4.5-W3.5-P0.50-TL_TI_RPH
  custom 1.2x1.1 smd: 1(-1.375,2.042) 15(1.375,2.042)
  rect 1.1x0.4 smd: 2(-1.425,0.682) 14(1.425,0.682)
  rect 0.85x0.25 smd: 3(-1.55,-0.393) 4(-1.55,-0.892) 5(-1.55,-1.393) 11(1.55,-1.393) 12(1.55,-0.892) 13(1.55,-0.393)
  custom 1.12x0.6 smd: 6(-1.4,-2.042) 10(1.4,-2.042)
  rect 0.25x0.7 smd: 7(-0.5,-1.992) 9(0.5,-1.992)
  rect 0.25x0.85 smd: 8(0,-1.917)
  rect 0.4x3 smd: 16(0,1.093)

## Nets
As in the schematic.

Pads without a net: CN1 3 4; SCREW1 1; SCREW2 1; SCREW3 1; U1 3 4; U3 3 4; U4 2 3 5; U5 3 4

## Via types
v1: diameter 0.61, hole 0.305, Top Layer to Bottom Layer, 74 vias

## Routing (per net, layer and track width the routed paths; a pad name or vN(x,y) marks a point on that pad's centre or on a via; arc(x,y) is an arc through that point)
24V: length 6.3
  Top Layer w0.254: U6.2 21.86,33.53 21.08,33.53 20.9,33.35 20.9,32.56 21.21,32.26 21.86,32.26 U6.14 22.53,31.34 U6.13
  vias: v1(22.35,36.19) v1(22.35,35.43) v1(23.11,36.19) v1(23.11,35.43)
AGND: length 15.4
  Top Layer w0.254: v1(13.59,29.34) 13.59,27.69 17.4,23.88 C34.1 ; U6.8 18.41,32.89 v1(17.65,32.13) ; v1(21.08,30.35) 21.08,31.34 U6.12 U6.11 ; R4.2 v1(16.51,29.21) ; C44.1 v1(13.59,30.86)
  vias: v1(11.05,39.75) v1(11.05,38.99) v1(11.05,38.23) v1(11.81,39.75) v1(11.81,38.99) v1(11.81,38.23) v1(12.57,39.75) v1(12.57,38.99) v1(12.57,38.23)
GND: length 67
  Top Layer w0.254: U6.15 v1(24.01,30.35) ; v1(49.78,32.89) C1.1 C13.1 C14.1 C15.1 C20.1 C22.1 C16.1 C17.1 ; v1(24,35.69) 24.01,35.68 U6.1 ; C24.1 C23.1 C25.1 C26.1 C27.1 C28.1 C29.1 C30.1 C32.1 v1(13.21,13.97) ; 3.17,16.47 v1(3.17,18.54) ; 37.63,9.74 v1(36.28,9.74) ; v1(32.48,15.49) C5.2 C3.2 C4.2 C12.2 C8.2 ; v1(46.64,12.91) U4.6
  vias: v1(4.95,21.46) v1(4.95,20.45) v1(5.97,21.46) v1(5.97,20.45) v1(26.42,5.84) v1(26.42,5.08) v1(27.18,5.84) v1(27.18,5.08) v1(27.94,5.84) v1(27.94,5.08) v1(30.61,39.5) v1(30.61,38.48) v1(31.37,39.5) v1(31.37,38.48) v1(32.13,39.5) v1(32.13,38.48) v1(35.72,20.79) v1(35.72,19.9) v1(35.72,19.01) v1(36.48,20.79) v1(36.48,19.9) v1(36.48,19.01) v1(36.7,31.75) v1(36.7,30.99) v1(37.24,20.79) v1(37.24,19.9) v1(37.24,19.01) v1(37.47,31.75) v1(37.47,30.99) v1(38.23,31.75) v1(38.23,30.99) v1(41.05,14.92) v1(41.05,14.01) v1(41.05,13.06) v1(41.05,12.18) v1(42.83,14.92) v1(42.83,14.01) v1(42.83,13.06) v1(42.83,12.18) v1(47.5,4.7) v1(47.5,3.68) v1(47.5,2.67) v1(48.39,4.7) v1(48.39,3.68) v1(48.39,2.67) v1(49.28,4.7) v1(49.28,3.68) v1(49.28,2.67)
$1N1787: length 3.4
  Top Layer w0.254: R2.1 R3.2 39.11,11.51 U4.4
$1N3489: length 1.8
  Top Layer w0.254: R1.2 LED1.1
$1N5856: length 3.5
  Top Layer w0.254: U4.1 39.24,16.76 39.75,17.27 C2.1
$2N684: length 21.4
  Top Layer w0.254: U6.6 19.93,34.29 13.97,34.29 13.59,33.91 C44.2 14.41,33.47 15.37,32.51 15.37,28.45 15.62,28.19 17.78,28.19 18.16,28.58 18.16,31.5 19.05,32.39 U6.9
$2N845: length 10.2
  Top Layer w0.254: U6.4 U6.3 21.58,36.82 21.97,37.21 25.4,37.21 26.16,36.45 C33.1
$2N860: length 8.3
  Top Layer w0.381: U7.1 26.16,29.08 C33.2 26.1,32.89 U6.16
$2N1084: length 2
  Top Layer w0.254: R6.1 19.93,29.47 U6.10
$2N1211: length 5
  Top Layer w0.254: U6.7 16.53,33.39 16.51,33.41 R4.1

## Copper pours and planes (outline as drawn; the poured copper is in the pictures)
5V on Top Layer: -4.57,19.05 6.9,19.05 6.9,23.37 4.06,23.37 4.06,24.38 14.35,24.38 14.35,19.05 33.02,19.05 33.02,29.97 38.35,29.97 38.35,25.02 41.4,25.02 41.4,-1.4 -4.57,-1.4
12V on Top Layer: 14.61,19.3 14.61,24.64 -5.33,24.64 -5.33,49.15 83.57,49.15 83.57,24.64 31.41,24.64 31.41,19.3
15V on Top Layer: 8.13,11.68 34.14,11.68 34.14,0 8.13,0
24V on Top Layer: 21.84,36.84 23.5,36.84 23.5,33.66 21.84,33.66
24V on Top Layer: 41.53,-1.4 41.53,33.15 26.8,33.15 26.8,37.34 74.8,37.34 74.8,-1.4
24V on Inner2: -4.44,53.59 84.58,53.59 84.58,-5.08 -4.44,-5.08
AGND on Top Layer: 10.41,40.39 16.38,40.39 16.38,37.59 10.41,37.59
AGND on Bottom Layer: -0.38,44.83 23.24,44.83 23.24,28.07 -0.38,28.07
GND on Top Layer: 16.51,40.39 33.02,40.39 33.02,38.1 16.51,38.1
GND on Top Layer: 35.18,21.34 40.11,21.34 40.11,18.47 35.18,18.47
GND on Top Layer: 3.9,23.37 6.48,23.37 6.48,19.94 3.9,19.94
GND on Top Layer: 46.99,5.59 52.41,5.59 52.41,1.79 46.99,1.79
GND on Top Layer: 24.51,6.48 28.8,6.48 28.8,3.91 24.51,3.91
GND on Top Layer: 27.12,30.35 27.12,33.08 41.4,33.08 41.4,30.35
GND on Bottom Layer: 25.4,-7.11 25.4,0.38 -1.14,0.38 -1.14,28.07 23.24,28.07 23.24,43.81 84.84,43.81 84.84,-7.11
GND on Inner1: -1.52,50.17 80.9,50.17 80.9,-2.29 -1.52,-2.29
$1N1431 on Top Layer: 41.53,29.84 45.47,29.84 45.47,14.86 41.53,14.86
$1N5102 on Top Layer: 59.18,29.46 66.81,29.46 66.81,18.54 59.18,18.54

## Text on the board
Bottom Silkscreen Layer: IN
Top Silkscreen Layer: OUT | IPM分电板 / 24V IN / 12V/15V/5V OUT
